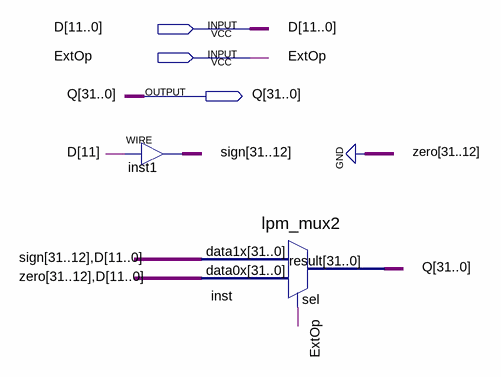
[diagram p0: schematic sheet]
// Quartus schematic ExtU.bdf as structural Verilog: 2 symbols, 3 pins
module ExtU (
  input  [11:0] D,
  input  ExtOp,
  output [31:0] Q
);

  wire [31:12] sign;

  assign sign = {20{D[11]}};  // WIRE inst1
  lpm_mux2 inst (.data1x({sign, D}), .data0x({{20{1'b0}}, D}), .sel(ExtOp), .result(Q));
endmodule
